# EAGLE schematic MAX485 (EAGLE 7.2.0)
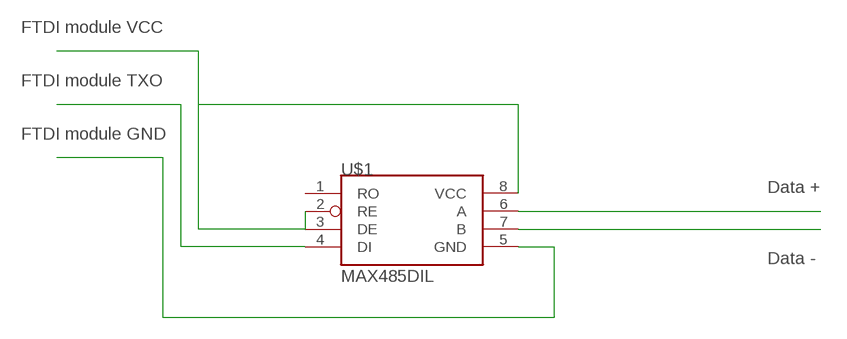
[diagram p0: schematic, sheet 1]

## Parts
U$1  MAX485DIL  [DIL08]

## Nets
N$1: U$1.2(RE) U$1.3(DE) U$1.8(VCC)
N$2: U$1.4(DI)
N$3: U$1.5(GND)
N$4: U$1.6(A)
N$5: U$1.7(B)
Unconnected: U$1.1(RO)

## Notes on the sheet
- FTDI module VCC
- FTDI module TXO
- FTDI module GND
- Data +
- Data -

## Library data of the parts
U$1 = SparkFun-DigitalIC:MAX485: RS-485 transceiver